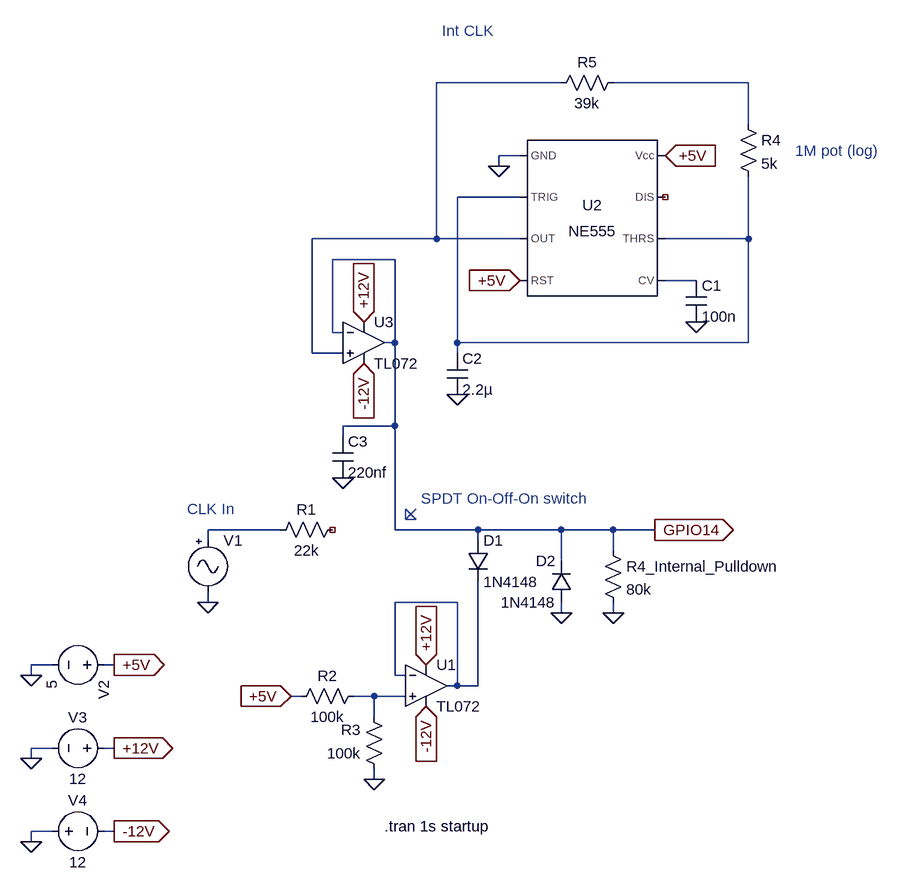
[diagram p0: schematic euclidean-rhythms-schematic.asc]
euclidean-rhythms-schematic.asc, the LTspice schematic file:
Version 4.1
SHEET 1 916 680
WIRE 144 -608 -48 -608
WIRE 432 -608 224 -608
WIRE 432 -544 432 -608
WIRE 80 -496 48 -496
WIRE 48 -480 48 -496
WIRE 80 -432 -16 -432
WIRE -48 -368 -48 -608
WIRE -48 -368 -240 -368
WIRE 80 -368 -48 -368
WIRE 432 -368 432 -464
WIRE 432 -368 304 -368
WIRE -112 -336 -208 -336
WIRE 352 -304 304 -304
WIRE -208 -224 -208 -336
WIRE -192 -224 -208 -224
WIRE -112 -208 -112 -336
WIRE -112 -208 -128 -208
WIRE -16 -208 -16 -432
WIRE 432 -208 432 -368
WIRE 432 -208 -16 -208
WIRE -240 -192 -240 -368
WIRE -192 -192 -240 -192
WIRE -16 -192 -16 -208
WIRE -112 -80 -112 -208
WIRE -112 -80 -192 -80
WIRE -192 -64 -192 -80
WIRE -288 80 -400 80
WIRE -112 80 -112 -80
WIRE 16 80 -112 80
WIRE 144 80 16 80
WIRE 224 80 144 80
WIRE 288 80 224 80
WIRE -400 96 -400 80
WIRE 16 96 16 80
WIRE 224 112 224 80
WIRE 144 128 144 80
WIRE -400 192 -400 176
WIRE -16 192 -112 192
WIRE 144 208 144 192
WIRE 224 208 224 192
WIRE -640 288 -672 288
WIRE -544 288 -560 288
WIRE -672 304 -672 288
WIRE -112 304 -112 192
WIRE -96 304 -112 304
WIRE -16 320 -16 192
WIRE -16 320 -32 320
WIRE 16 320 16 160
WIRE 16 320 -16 320
WIRE -256 336 -272 336
WIRE -144 336 -176 336
WIRE -96 336 -144 336
WIRE -144 368 -144 336
WIRE -640 416 -672 416
WIRE -544 416 -560 416
WIRE -672 432 -672 416
WIRE -144 464 -144 448
WIRE -640 544 -672 544
WIRE -544 544 -560 544
WIRE -672 560 -672 544
FLAG -400 192 0
FLAG 144 208 0
FLAG -672 304 0
FLAG -144 464 0
FLAG -544 288 +5V
IOPIN -544 288 Out
FLAG -272 336 +5V
IOPIN -272 336 In
FLAG 288 80 GPIO14
IOPIN 288 80 Out
FLAG -672 432 0
FLAG -672 560 0
FLAG -544 416 +12V
IOPIN -544 416 Out
FLAG -544 544 -12V
IOPIN -544 544 Out
FLAG -64 288 +12V
IOPIN -64 288 In
FLAG -64 352 -12V
IOPIN -64 352 In
FLAG 224 208 0
FLAG 48 -480 0
FLAG 304 -496 +5V
IOPIN 304 -496 In
FLAG 352 -240 0
FLAG 80 -304 +5V
IOPIN 80 -304 In
FLAG -16 -128 0
FLAG -160 -240 +12V
IOPIN -160 -240 In
FLAG -160 -176 -12V
IOPIN -160 -176 In
FLAG -192 0 0
SYMBOL res -192 64 R90
WINDOW 0 0 56 VBottom 2
WINDOW 3 32 56 VTop 2
SYMATTR InstName R1
SYMATTR Value 22k
SYMBOL diode 0 96 R0
SYMATTR InstName D1
SYMATTR Value 1N4148
SYMBOL diode 160 192 R180
WINDOW 0 24 64 Left 2
WINDOW 3 24 0 Left 2
SYMATTR InstName D2
SYMATTR Value 1N4148
SYMBOL Misc\\signal -400 80 R0
WINDOW 3 24 104 Invisible 2
WINDOW 123 0 0 Left 0
WINDOW 39 0 0 Left 0
SYMATTR Value PULSE(0 5 1ms 1us 1us 5ms 50ms)
SYMATTR InstName V1
SYMBOL voltage -544 288 R90
WINDOW 123 0 0 Left 0
WINDOW 39 0 0 Left 0
SYMATTR InstName V2
SYMATTR Value 5
SYMBOL res -160 320 R90
WINDOW 0 0 56 VBottom 2
WINDOW 3 32 56 VTop 2
SYMATTR InstName R2
SYMATTR Value 100k
SYMBOL res -128 464 R180
WINDOW 0 36 76 Left 2
WINDOW 3 36 40 Left 2
SYMATTR InstName R3
SYMATTR Value 100k
SYMBOL voltage -544 416 R90
WINDOW 0 -32 56 VBottom 2
WINDOW 3 32 56 VTop 2
WINDOW 123 0 0 Left 0
WINDOW 39 0 0 Left 0
SYMATTR InstName V3
SYMATTR Value 12
SYMBOL voltage -656 544 R270
WINDOW 0 32 56 VTop 2
WINDOW 3 -32 56 VBottom 2
WINDOW 123 0 0 Left 0
WINDOW 39 0 0 Left 0
SYMATTR InstName V4
SYMATTR Value 12
SYMBOL OpAmps\\TL072 -64 256 R0
SYMATTR InstName U1
SYMBOL res 208 96 R0
SYMATTR InstName R4_Internal_Pulldown
SYMATTR Value 80k
SYMBOL Misc\\NE555 192 -400 R0
SYMATTR InstName U2
SYMBOL cap 336 -304 R0
SYMATTR InstName C1
SYMATTR Value 100n
SYMBOL cap -32 -192 R0
WINDOW 3 24 56 Left 2
SYMATTR InstName C2
SYMATTR Value 2.2µ
SYMATTR Description Capacitor
SYMATTR Type cap
SYMATTR SpiceLine V=10 Irms=0 Rser=7 Lser=0 mfg="AVX" pn="TAJA225M010" type="Tantalum"
SYMBOL res 416 -560 R0
SYMATTR InstName R4
SYMATTR Value 5k
SYMBOL res 240 -624 R90
WINDOW 0 0 56 VBottom 2
WINDOW 3 32 56 VTop 2
SYMATTR InstName R5
SYMATTR Value 39k
SYMBOL OpAmps\\TL072 -160 -272 R0
SYMATTR InstName U3
SYMBOL cap -208 -64 R0
SYMATTR InstName C3
SYMATTR Value 220nf
TEXT -128 536 Left 2 !.tran 1s startup
TEXT -432 48 Left 2 ;CLK In
TEXT 504 -504 Left 2 ;1M pot (log)
TEXT -40 -688 Left 2 ;Int CLK
TEXT -72 32 Left 2 ;SPDT On-Off-On switch
LINE Normal -96 64 -80 48
LINE Normal -96 48 -96 64
LINE Normal -80 64 -96 48
LINE Normal -96 64 -80 64

The netlist it stands for:
* euclidean-rhythms-schematic.asc
R1 NC_01 N005 22k
D1 GPIO14 N006 1N4148
D2 0 GPIO14 1N4148
V1 N005 0 PULSE(0 5 1ms 1us 1us 5ms 50ms)
V2 +5V 0 5
R2 N007 +5V 100k
R3 0 N007 100k
V3 +12V 0 12
V4 0 -12V 12
X§U1 N007 N006 +12V -12V N006 TL072  ; pins In+ In- V+ V- OUT
R4_Internal_Pulldown GPIO14 0 80k
X§U2 0 N003 N001 +5V N004 N003 NC_02 +5V NE555  ; pins GND TRIG OUT RST CV THRS DIS Vcc
C1 N004 0 100n
C2 N003 0 2.2µ V=10 Irms=0 Rser=7 Lser=0 mfg="AVX" pn="TAJA225M010" type="Tantalum"
R4 N002 N003 5k
R5 N002 N001 39k
X§U3 N001 GPIO14 +12V -12V GPIO14 TL072  ; pins In+ In- V+ V- OUT
C3 GPIO14 0 220nf
.model D D
.lib standard.dio
.tran 1s startup
* CLK In
* 1M pot (log)
* Int CLK
* SPDT On-Off-On switch
.lib NE555.sub
.backanno
.end